# EAGLE design shield_led (EAGLE 6.5.0)
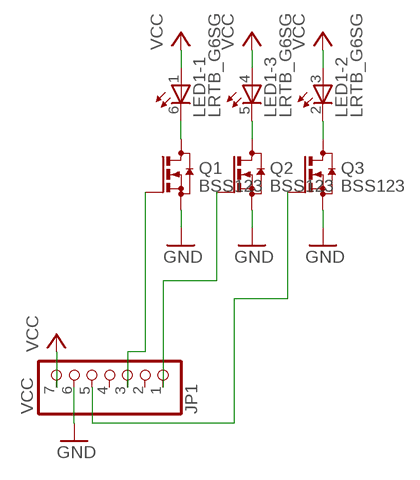
[diagram p0: schematic, sheet 1]

## Parts
JP1  VCC  PINHD-1X7  [1X07]
LED1  LRTB_G6SG  [LRTB_G6SG]
Q1  BSS123  [SOT23]
Q2  BSS123  [SOT23]
Q3  BSS123  [SOT23]

## Nets
GND: JP1.6 Q1.2(S) Q2.2(S) Q3.2(S)
N$1: LED1.6(-1:C) Q1.3(D)
N$2: LED1.2(-2:C) Q3.3(D)
N$3: LED1.5(-3:C) Q2.3(D)
N$4: JP1.3 Q1.1(G)
N$5: JP1.1 Q2.1(G)
N$6: JP1.5 Q3.1(G)
VCC: JP1.7 LED1.1(-1:A) LED1.3(-2:A) LED1.4(-3:A)
Unconnected: JP1.2 JP1.4

## Library data of the parts
JP1 = pinhead:PINHD-1X7: PIN HEADER
LED1 = led:LRTB_G6SG: LRTB G6SG 6-lead TOPLED® Source: OSRAM Opto Semiconductors ... LRTB_G6SG_Pb_free.pdf
Q1-Q3 = transistor-small-signal:BSS123: N-CHANNEL MOS FET

## Board
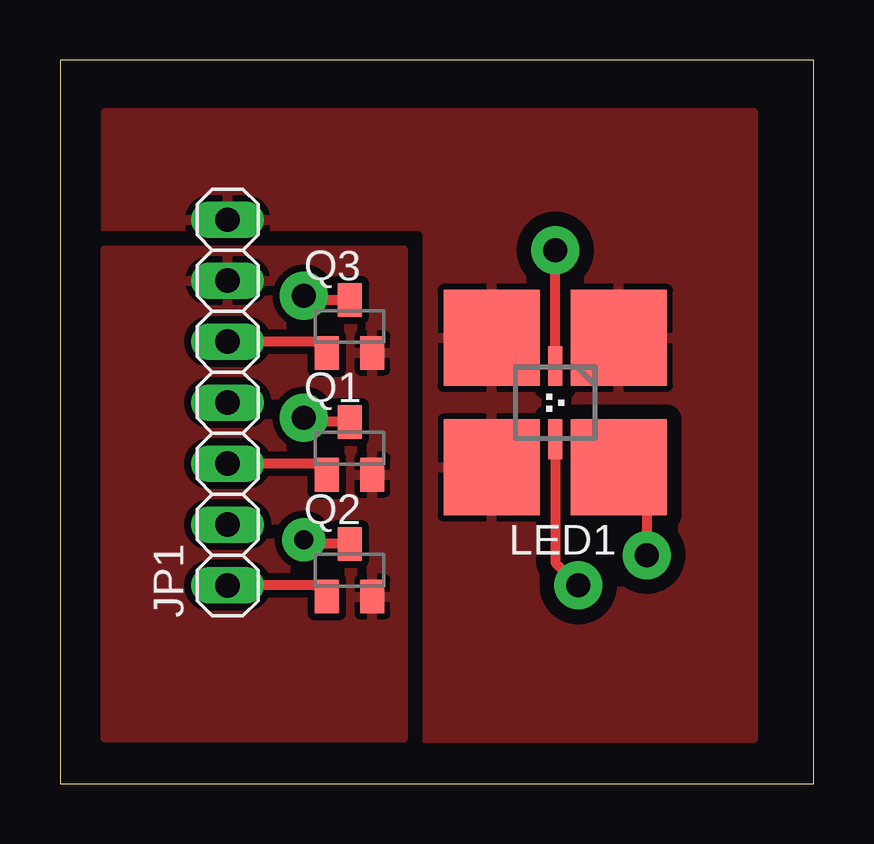
[diagram p1: board, top side]
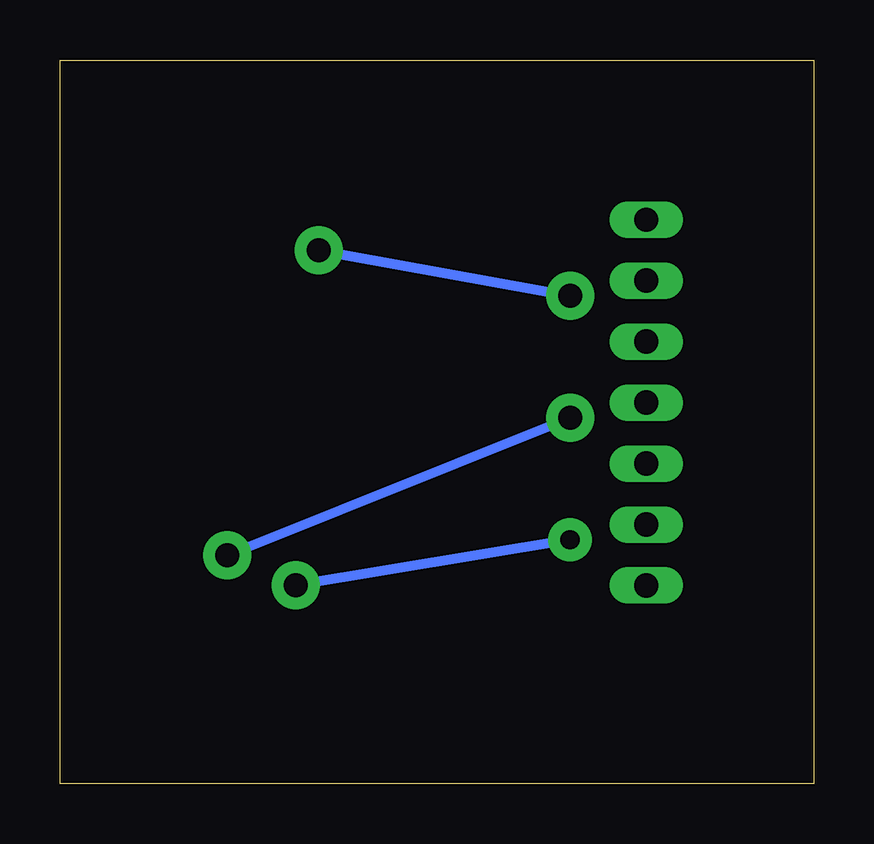
[diagram p2: board, bottom side, seen from below]

Size 31.41 x 30.15 mm. Coordinates in mm from the lower left corner, seen from the top.
Outline: 0,0 31.41,0 31.41,30.15 0,30.15 0,0
Copper layers (1*16): Top 0.035mm / dielectric 1.5mm / Bottom 0.035mm
Design rules "default *": minimum track width 0.4mm, minimum drill 0.8mm, track to track 8mil, track to pad 8mil, pad to pad 8mil, via to via 8mil, smd to smd 8mil, copper to edge 40mil, drill to drill 8mil, minimum pad ring 10mil, minimum via ring 0.5mm, stop-mask expansion 4mil, vias tented up to drill 0mil, thermal gap 10mil

### Footprints (pad centres in the part's own frame; a part is rotated, then mirrored left to right if it is on the bottom)
1X07 = drill 1.016 long: 1 -7.62,0; 2 -5.08,0; 3 -2.54,0; 4 0,0; 5 2.54,0; 6 5.08,0; 7 7.62,0
LRTB_G6SG = smd 4 x 4: 1 -2.65,-2.7; 3 2.65,-2.7; 4 2.65,2.7; 6 -2.65,2.7 | smd 0.6 x 1.65: 2 0,-1.525; 5 0,1.525
SOT23 = smd 1 x 1.4: 1 -0.95,-1.1; 2 0.95,-1.1; 3 0,1.1

### Placement (x,y rotation side)
JP1  6.98,15.88 90 top
LED1  20.64,15.88 180 top
Q1  12.07,13.97 0 top
Q2  12.07,8.89 0 top
Q3  12.07,19.05 0 top

### Tracks (layer width: path | path; a pad name or v marks a point on that pad's centre or on a via)
GND
  pour Top (isolate 0.305): 1.91,22.23 14.29,22.23 14.29,1.91 1.91,1.91
N$1  (via drill 1)
  Top 0.406: Q1.3 10.96,15.07 v10.16,15.24 | LED1.6 24.45,12.02 v24.45,9.52
  Bottom 0.406: v24.45,9.52 v10.16,15.24
N$2  (via drill 1)
  Top 0.406: LED1.2 v20.64,22.23 | Q3.3 10.96,20.15 v10.16,20.32
  Bottom 0.406: v20.64,22.23 v10.16,20.32
N$3  (via drill 0.8, 1)
  Top 0.406: Q2.3 10.96,9.99 v10.16,10.16 | LED1.5 20.64,9.21 v21.59,8.26
  Bottom 0.406: v10.16,10.16 v21.59,8.26
N$4
  Top 0.406: Q1.1 10.65,13.34 JP1.3
N$5
  Top 0.406: Q2.1 10.65,8.26 JP1.1
N$6
  Top 0.406: Q3.1 10.65,18.41 JP1.5
VCC
  pour Top (isolate 0.61, rank 2): 1.91,1.91 28.89,1.91 28.89,27.94 1.91,27.94